# EAGLE design tiny2313_stepper_B (EAGLE 5.02)
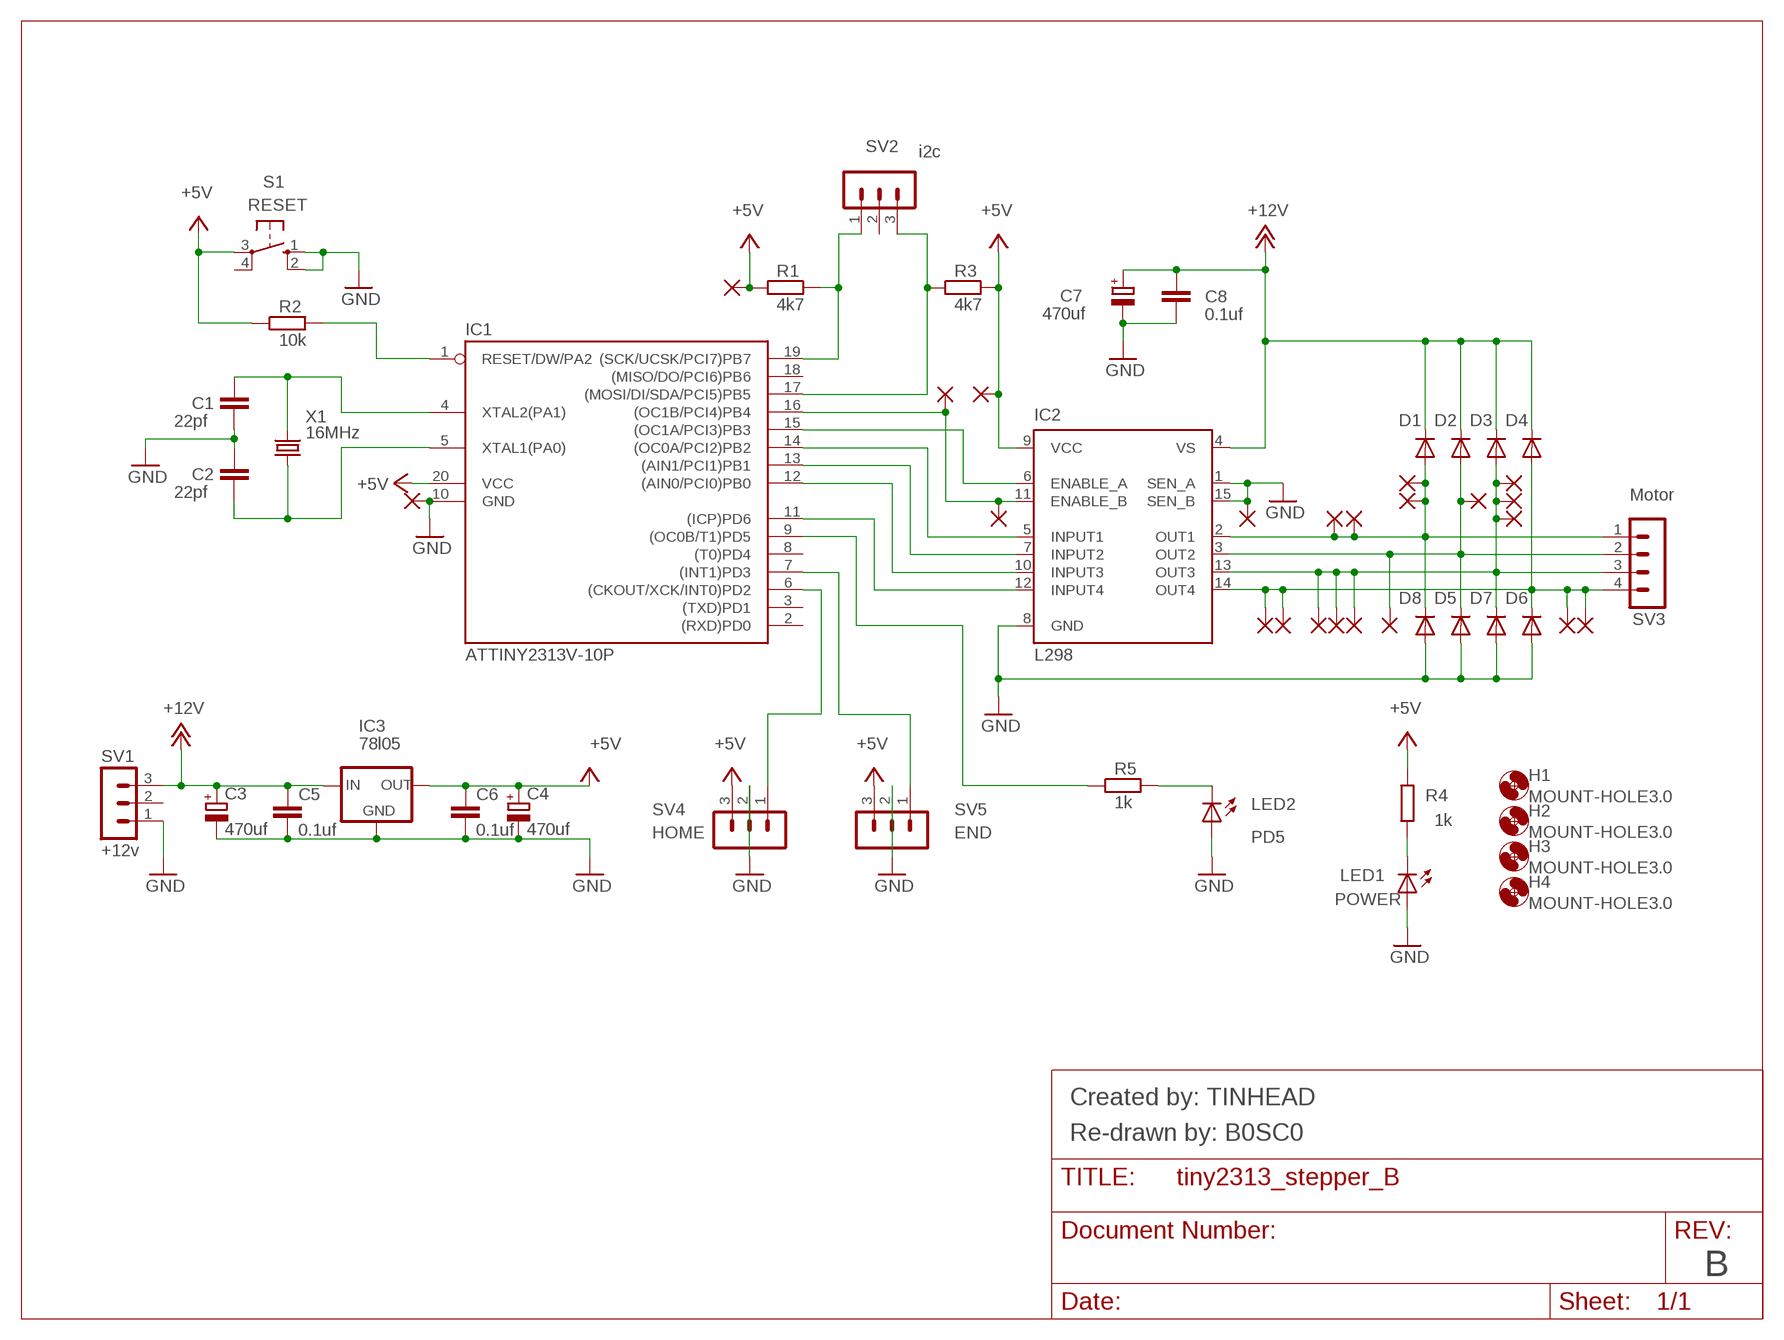
[diagram p0: schematic, sheet 1]

## Parts
C1  22pf  C-EU025-024X044  [C025-024X044]
C2  22pf  C-EU025-024X044  [C025-024X044]
C3  470uf  CPOL-EUE3.5-8  [E3,5-8]
C4  470uf  CPOL-EUE3.5-8  [E3,5-8]
C5  0.1uf  C-EU025-025X050  [C025-025X050]
C6  0.1uf  C-EU025-025X050  [C025-025X050]
C7  470uf  CPOL-EUE3.5-8  [E3,5-8]
C8  0.1uf  C-EU025-025X050  [C025-025X050]
D1  1N4004  [DO41-10]
D2  1N4004  [DO41-10]
D3  1N4004  [DO41-10]
D4  1N4004  [DO41-10]
D5  1N4004  [DO41-10]
D6  1N4004  [DO41-10]
D7  1N4004  [DO41-10]
D8  1N4004  [DO41-10]
H1  MOUNT-HOLE3.0  [3,0]
H2  MOUNT-HOLE3.0  [3,0]
H3  MOUNT-HOLE3.0  [3,0]
H4  MOUNT-HOLE3.0  [3,0]
IC1  ATTINY2313V-10P  [DIL20]
IC2  L298  [MULTIWATT-15]
IC3  78l05  78LXX  [78LXX]
LED1  POWER  LED5MM  [LED5MM]
LED2  PD5  LED5MM  [LED5MM]
PAD1  1,6/0,9  [1,6/0,9]
PAD2  1,6/0,9  [1,6/0,9]
PAD3  1,6/0,9  [1,6/0,9]
PAD4  1,6/0,9  [1,6/0,9]
PAD5  1,6/0,9  [1,6/0,9]
PAD6  1,6/0,9  [1,6/0,9]
PAD7  1,6/0,9  [1,6/0,9]
PAD8  1,6/0,9  [1,6/0,9]
PAD9  1,6/0,9  [1,6/0,9]
PAD10  1,6/0,9  [1,6/0,9]
PAD11  1,6/0,9  [1,6/0,9]
PAD12  1,6/0,9  [1,6/0,9]
PAD13  1,6/0,9  [1,6/0,9]
PAD14  1,6/0,9  [1,6/0,9]
PAD15  1,6/0,9  [1,6/0,9]
PAD16  1,6/0,9  [1,6/0,9]
PAD17  1,6/0,9  [1,6/0,9]
PAD18  1,6/0,9  [1,6/0,9]
PAD19  1,6/0,9  [1,6/0,9]
PAD20  1,6/0,9  [1,6/0,9]
PAD21  1,6/0,9  [1,6/0,9]
PAD22  1,6/0,9  [1,6/0,9]
R1  4k7  R-EU_0204/7  [0204/7]
R2  10k  R-EU_0204/7  [0204/7]
R3  4k7  R-EU_0204/7  [0204/7]
R4  1k  R-EU_0204/7  [0204/7]
R5  1k  R-EU_0204/7  [0204/7]
S1  RESET  10-XX  [B3F-10XX]
SV1  +12v  MA03-1  [MA03-1]
SV2  i2c  MA03-1  [MA03-1]
SV3  Motor  MA04-1  [MA04-1]
SV4  HOME  MA03-1  [MA03-1]
SV5  END  MA03-1  [MA03-1]
X1  16MHz  CRYSTALHC49S  [HC49/S]

## Nets
+5V: C4.+ C6.1 IC1.20(VCC) IC2.9(VCC) IC3.OUT PAD7.1(P) PAD8.1(P) R1.2 R2.1 R3.2 R4.2 S1.3(P) SV4.3 SV5.3
+12V: C3.+ C5.1 C7.+ C8.1 D1.C D2.C D3.C D4.C IC2.4(VS) IC3.IN SV1.3
GND: C1.1 C2.1 C3.- C4.- C5.2 C6.2 C7.- C8.2 D5.A D6.A D7.A D8.A IC1.10(GND) IC2.1(SEN_A) IC2.8(GND) IC2.15(SEN_B) IC3.GND LED1.A LED2.A PAD17.1(P) PAD18.1(P) S1.1(S) S1.2(S1) SV1.1 SV4.2 SV5.2
N$1: C2.2 IC1.5(XTAL1(PA0)) X1.1
N$3: IC1.1(RESET/DW/PA2) R2.2
N$4: C1.2 IC1.4(XTAL2(PA1)) X1.2
N$5: IC1.17((MOSI/DI/SDA/PCI5)PB5) R3.1 SV2.3
N$6: IC1.6((CKOUT/XCK/INT0)PD2) SV4.1
N$7: IC1.16((OC1B/PCI4)PB4) IC2.11(ENABLE_B) PAD11.1(P) PAD12.1(P)
N$8: IC1.15((OC1A/PCI3)PB3) IC2.6(ENABLE_A)
N$9: IC1.14((OC0A/PCI2)PB2) IC2.5(INPUT1)
N$10: IC1.13((AIN1/PCI1)PB1) IC2.7(INPUT2)
N$11: IC1.12((AIN0/PCI0)PB0) IC2.10(INPUT3)
N$12: IC1.11((ICP)PD6) IC2.12(INPUT4)
N$13: IC1.7((INT1)PD3) SV5.1
N$14: D1.A D8.C IC2.2(OUT1) PAD3.1(P) PAD4.1(P) PAD5.1(P) PAD6.1(P) SV3.1
N$15: D2.A D5.C IC2.3(OUT2) PAD9.1(P) PAD10.1(P) SV3.2
N$16: D3.A D7.C IC2.13(OUT3) PAD13.1(P) PAD14.1(P) PAD15.1(P) PAD16.1(P) PAD21.1(P) PAD22.1(P) SV3.3
N$18: D4.A D6.C IC2.14(OUT4) PAD1.1(P) PAD2.1(P) PAD19.1(P) PAD20.1(P) SV3.4
N$19: LED1.K(C) R4.1
N$20: LED2.K(C) R5.2
N$22: IC1.9((OC0B/T1)PD5) R5.1
N$23: IC1.19((SCK/UCSK/PCI7)PB7) R1.1 SV2.1
Unconnected: IC1.2((RXD)PD0) IC1.3((TXD)PD1) IC1.8((T0)PD4) IC1.18((MISO/DO/PCI6)PB6) S1.4(P1) SV1.2 SV2.2

## Notes on the sheet
- Created by: TINHEAD
- Re-drawn by: B0SC0
- B

## Library data of the parts
C1 C2 = resistor:C-EU: CAPACITOR, European symbol
C3 C4 C7 = rcl:CPOL-EU: POLARIZED CAPACITOR, European symbol
C5 C6 C8 = rcl:C-EU: CAPACITOR, European symbol
D1-D8 = diode:1N4004: DIODE general purpose rectifier, 1 A
H1-H4 = holes:MOUNT-HOLE: MOUNTING HOLE with drill center marker
IC1 = avr:ATTINY2313: MICROCONTROLLER 2 Kbytes FLASH 128 bytes SRAM 128 bytes EEPROM USART USI
IC2 = st-microelectronics:L298: DUAL FULL-BRIDGE DRIVER
IC3 = v-reg:78LXX: VOLTAGE REGULATOR
LED1 LED2 = led:LED: LED OSRAM: - CHIPLED LG R971, LG N971, LY N971, LG Q971, LY Q971, LO R971, LY R971 LH N974, LH R974 LS Q976, LO Q976, LY Q976 LO Q996 - Hyper CHIPLED LW Q18S LB Q993, LB Q99A, LB R99A - SideLED LS A670, LO A670, LY A670, LG A670, LP A670 LB A673, LV A673, LT A673, LW A673 LH A674 LY A675 LS A676, LA A676, LO A676, LY A676, LW A676 LS A679, LY A679, LG A679 - Hyper Micro SIDELED® LS Y876, LA Y876, LO Y876, LY Y876 LT Y87S - SmartLED LW L88C, LW L88S LB L89C, LB L89S, LG L890 LS L89K, LO L89K, LY L89K LS L896, LA L896, LO L896, LY L896 - TOPLED LS T670, LO T670, LY T670, LG T670, LP T670 LSG T670, LSP T670, LSY T670, LOP T670, LYG T670 LG T671, LOG T671, LSG T671 LB T673, LV T673, LT T673, LW T673 LH T674 LS T676, LA T676, LO T676, LY T676, LB T676, LH T676, LSB T676, LW T676 LB T67C, LV T67C, LT T67C, LS T67K, LO T67K, LY T67K, LW E67C LS E67B, LA E67B, LO E67B, LY E67B, LB E67C, LV E67C, LT E67C LW T67C LS T679, LY T679, LG T679 LS T770, LO T770, LY T770, LG T770, LP T770 LB T773, LV T773, LT T773, LW T773 LH T774 LS E675, LA E675, LY E675, LS T675 LS T776, LA T776, LO T776, LY T776, LB T776 LHGB T686 LT T68C, LB T68C - Hyper Mini TOPLED® LB M676 - Mini TOPLED Santana® LG M470 LS M47K, LO M47K, LY M47K Source: http://www.osram.convergy.de LUXEON: - LUMILED® LXK2-PW12-R00, LXK2-PW12-S00, LXK2-PW14-U00, LXK2-PW14-V00 LXK2-PM12-R00, LXK2-PM12-S00, LXK2-PM14-U00 LXK2-PE12-Q00, LXK2-PE12-R00, LXK2-PE12-S00, LXK2-PE14-T00, LXK2-PE14-U00 LXK2-PB12-K00, LXK2-PB12-L00, LXK2-PB12-M00, LXK2-PB14-N00, LXK2-PB14-P00, LXK2-PB14-Q00 LXK2-PR12-L00, LXK2-PR12-M00, LXK2-PR14-Q00, LXK2-PR14-R00 LXK2-PD12-Q00, LXK2-PD12-R00, LXK2-PD12-S00 LXK2-PH12-R00, LXK2-PH12-S00 LXK2-PL12-P00, LXK2-PL12-Q00, LXK2-PL12-R00 Source: www.luxeon.com KINGBRIGHT: KA-3528ASYC Source: www.kingbright.com
PAD1-PAD22 = wirepad:1,6/0,9: THROUGH-HOLE PAD
R1 R3 = resistor:R-EU_: RESISTOR, European symbol
R2 R4 R5 = rcl:R-EU_: RESISTOR, European symbol
S1 = switch-omron:10-XX: OMRON SWITCH
SV1 SV2 SV4 SV5 = con-lstb:MA03-1: PIN HEADER
SV3 = con-lstb:MA04-1: PIN HEADER
X1 = crystal:CRYSTAL: CRYSTAL

## Board
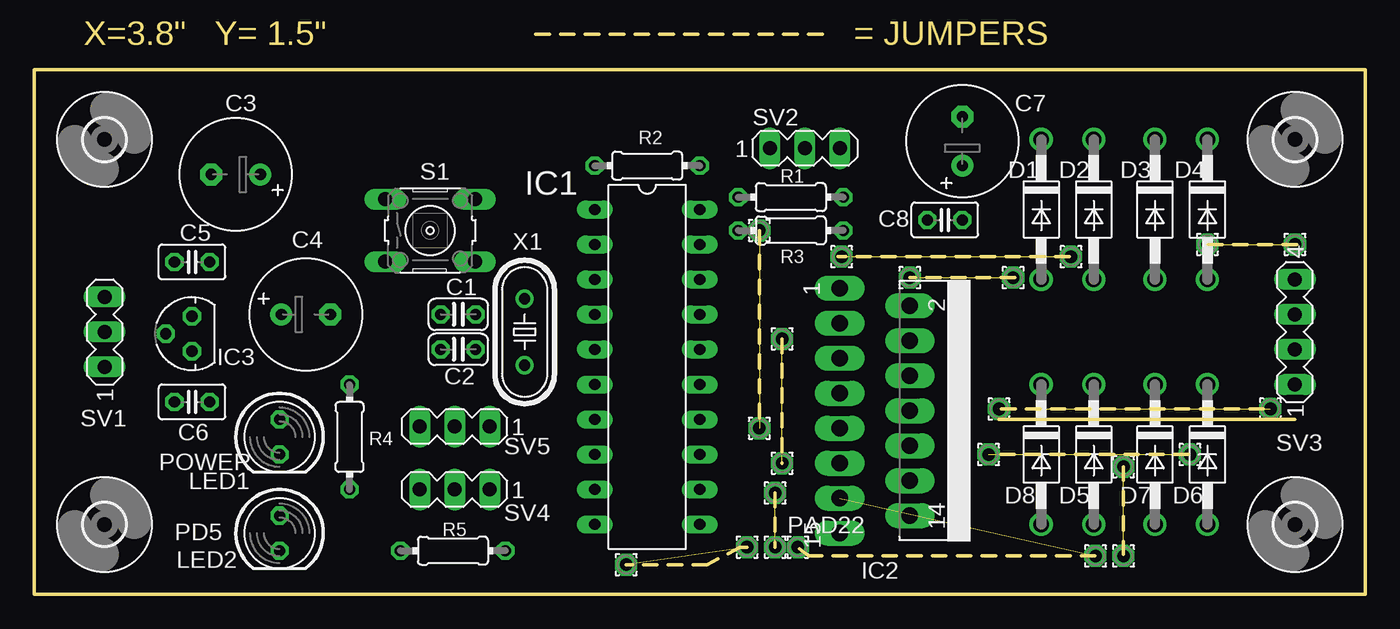
[diagram p1: board, top side]
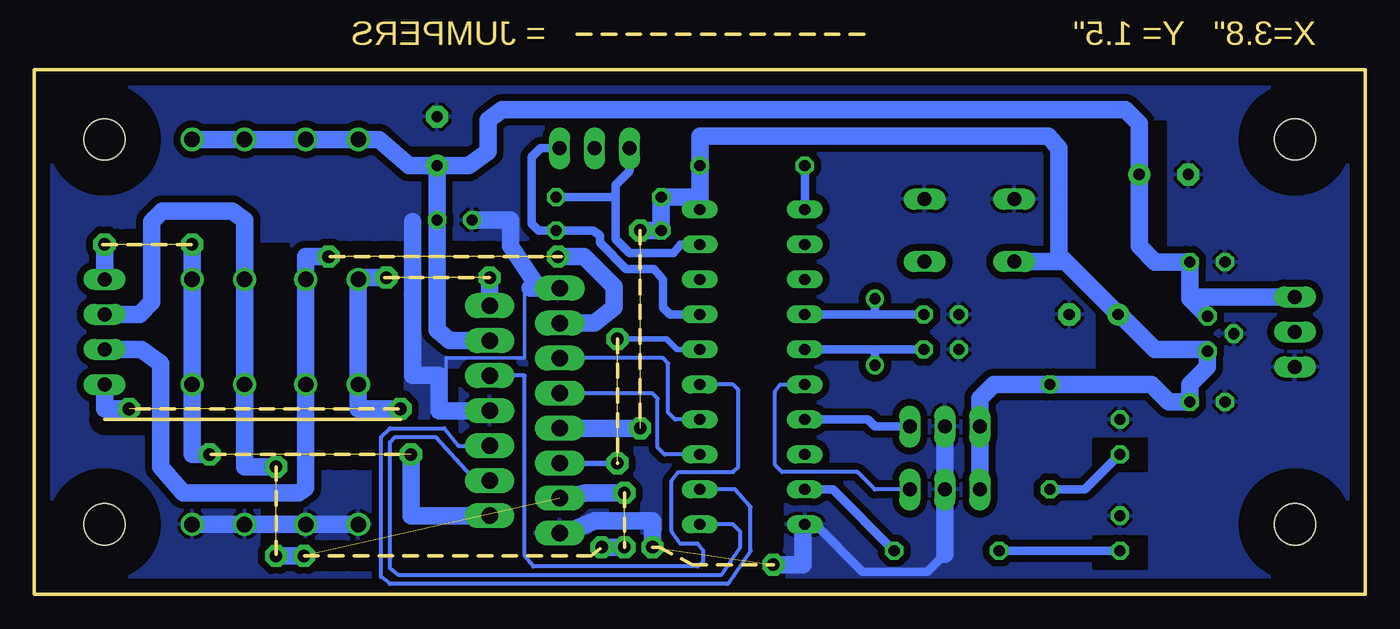
[diagram p2: board, bottom side, seen from below]

Size 96.52 x 40.64 mm. Coordinates in mm from the lower left corner, seen from the top.
Outline: 89.15,13.46 69.98,13.46
Outline: 91.57,25.4 85.09,25.4
Outline: 71.12,22.99 63.5,22.99
Outline: 52.58,26.42 52.58,12.06
Outline: 75.06,24.51 58.29,24.51
Outline: 54.23,18.54 54.23,9.53
Outline: 78.99,9.27 78.99,2.92
Outline: 55.5,3.3 56.13,2.79 76.96,2.79
Outline: 51.69,3.43 51.18,3.43 48.77,2.16 42.93,2.16
Outline: 57.15,40.64 35.69,40.64
Outline: 83.69,10.16 69.34,10.16
Outline: 53.72,7.37 53.72,3.43
Outline: 0,0 96.52,0 96.52,38.1 0,38.1 0,0
Copper layers (1+16): Top 0.035mm / dielectric 1.5mm / Bottom 0.035mm
Design rules "default *": minimum track width 10mil, minimum drill 24mil, track to track 20mil, track to pad 20mil, pad to pad 20mil, via to via 20mil, smd to smd 20mil, copper to edge 40mil, drill to drill 8mil, minimum pad ring 10mil, minimum via ring 8mil, stop-mask expansion 4mil, vias tented up to drill 0mil, thermal gap 10mil
bRestrict: area 78.1,14.5 to 79.9,25.4; area 70,14.6 to 71.8,21.6; area 69.8,14.9 to 71.6,21.6; area 70.1,14.7 to 71.9,21.7; area 14.5,25.5 to 19.7,34.3; area 15.5,16.4 to 19.4,22.4; area 15.9,9 to 19.7,11.3; area 15.9,1.9 to 19.7,4.2; area 64.9,30.1 to 69.5,32.4; area 42.3,3.4 to 46.4,31.8; area 60.1,17.1 to 61.8,23.9; area 65.9,10.2 to 67.7,16.3; 1 more areas

### Footprints (pad centres in the part's own frame; a part is rotated, then mirrored left to right if it is on the bottom)
C025-024X044 = drill 0.813 octagon: 1 -1.27,0; 2 1.27,0
E3,5-8 = drill 0.813 pad 1.6 round: + -1.778,0 | drill 0.813 pad 1.6 octagon: - 1.778,0
C025-025X050 = drill 0.813 octagon: 1 -1.27,0; 2 1.27,0
DO41-10 = drill 1.118 round: A 5.08,0; C -5.08,0
3,0 = hole 3: 0,0
DIL20 = drill 0.813 long: 1 -11.43,-3.81; 2 -8.89,-3.81; 3 -6.35,-3.81; 4 -3.81,-3.81; 5 -1.27,-3.81; 6 1.27,-3.81; 7 3.81,-3.81; 8 6.35,-3.81; 9 8.89,-3.81; 10 11.43,-3.81; 11 11.43,3.81; 12 8.89,3.81; 13 6.35,3.81; 14 3.81,3.81; 15 1.27,3.81; 16 -1.27,3.81; 17 -3.81,3.81; 18 -6.35,3.81; 19 -8.89,3.81; 20 -11.43,3.81
MULTIWATT-15 = drill 1.2 long: 1 -8.89,-7.62; 2 -7.62,-2.54; 3 -6.35,-7.62; 4 -5.08,-2.54; 5 -3.81,-7.62; 6 -2.54,-2.54; 7 -1.27,-7.62; 8 0,-2.54; 9 1.27,-7.62; 10 2.54,-2.54; 11 3.81,-7.62; 12 5.08,-2.54; 13 6.35,-7.62; 14 7.62,-2.54; 15 8.89,-7.62
78LXX = drill 0.813 octagon: GND 0,1.905; IN 1.27,0; OUT -1.27,0
LED5MM = drill 0.813 octagon: A -1.27,0; K 1.27,0
1,6/0,9 = drill 0.914 pad 1.6 octagon: 1 0,0
0204/7 = drill 0.813 octagon: 1 -3.81,0; 2 3.81,0
B3F-10XX = drill 1.016 long: 1 -3.251,2.261; 2 3.251,2.261; 3 -3.251,-2.261; 4 3.251,-2.261
MA03-1 = drill 1.016 long: 1 -2.54,0; 2 0,0; 3 2.54,0
MA04-1 = drill 1.016 long: 1 -3.81,0; 2 -1.27,0; 3 1.27,0; 4 3.81,0
HC49/S = drill 0.813 round: 1 -2.413,0; 2 2.413,0

### Placement (x,y rotation side)
C1  30.73,20.32 0 top
C2  30.73,17.78 0 top
C3  14.61,30.48 180 top
C4  19.68,20.32 0 top
C5  11.43,24.13 180 top
C6  11.43,13.97 180 top
C7  67.31,32.89 90 top
C8  66.04,27.18 180 top
D1  73.03,27.94 270 top
D2  76.83,27.94 270 top
D3  81.28,27.94 270 top
D4  85.09,27.94 270 top
D5  76.83,10.16 270 top
D6  85.09,10.16 270 top
D7  81.28,10.16 270 top
D8  73.03,10.16 270 top
H1  5.08,33.02 0 top
H2  5.08,5.08 0 top
H3  91.44,5.08 0 top
H4  91.44,33.02 0 top
IC1  44.45,16.51 270 top
IC2  66.04,13.34 270 top
IC3  11.43,18.92 90 top
LED1  17.78,11.43 270 top
LED2  17.78,4.45 270 top
PAD1  91.44,25.4 0 top
PAD2  85.09,25.4 0 top
PAD3  89.66,13.46 0 top
PAD4  69.98,13.46 0 top
PAD5  70.99,22.99 0 top
PAD6  63.5,22.99 0 top
PAD7  52.58,12.06 0 top
PAD8  52.58,26.42 0 top
PAD9  58.55,24.51 0 top
PAD10  75.18,24.51 0 top
PAD11  54.23,18.54 0 top
PAD12  54.23,9.53 0 top
PAD13  53.72,7.37 0 top
PAD14  78.99,9.27 0 top
PAD15  76.96,2.79 0 top
PAD16  78.99,2.79 0 top
PAD17  51.69,3.43 0 top
PAD18  42.93,2.16 0 top
PAD19  69.22,10.16 0 top
PAD20  83.82,10.16 0 top
PAD21  53.72,3.43 0 top
PAD22  55.37,3.43 0 top
R1  54.86,28.83 180 top
R2  44.45,31.11 180 top
R3  54.86,26.42 180 top
R4  22.86,11.43 90 top
R5  30.35,3.17 180 top
S1  28.7,26.42 0 top
SV1  5.08,19.05 90 top
SV2  55.88,32.38 0 top
SV3  91.44,19.05 90 top
SV4  30.48,7.62 180 top
SV5  30.48,12.19 180 top
X1  35.56,19.05 90 top

### Tracks (layer width: path | path; a pad name or v marks a point on that pad's centre or on a via)
+5V  (1 unrouted)
  Bottom 0.305: 17.78,20.32 C4.+ | 11.43,17.78 IC3.OUT | SV4.3 SV5.3
  Bottom 1.27: 17.78,20.32 15.24,17.78 11.43,17.78 11.43,16.51 12.7,15.24 C6.1 14.22,13.97 15.49,15.24 R4.2 26.92,15.24 27.94,14.22 SV4.3 | 48.26,28.83 R2.1 48.26,33.27 22.99,33.27 22.23,32.38 22.23,24.64 21.84,24.26 | C4.+ 17.91,20.45 18.03,20.45 21.84,24.26 | S1.3 21.95,24.16 21.84,24.26 | 48.26,28.83 R1.2 R3.2 PAD8.1 | 48.26,28.83 IC1.20 | PAD7.1 IC2.9
+12V
  Bottom 0.305: 12.7,21.59 IC3.IN
  Bottom 1.27: IC3.IN 12.7,21.46 12.7,21.59 | 12.7,21.59 C5.1 15.24,24.13 16.38,25.27 C3.+ 16.38,34.16 17.4,35.18 62.61,35.18 63.63,34.42 63.63,32.13 65.02,31.11 C7.+ | SV1.3 12.7,21.59 | D4.C D3.C D2.C D1.C 71.5,33.02 69.34,31.11 C7.+ | C7.+ C8.1 67.31,19.18 66.42,18.41 IC2.4
GND  (1 unrouted)
  Bottom 0.254: 60.58,22.23 60.96,22.23 60.96,17.14 66.67,17.14 66.67,13.34 65.91,13.34
  Bottom 0.61: 30.48,2.92 31.75,1.65 36.45,1.65 39.88,5.08 IC1.10 40.77,5.08
  Bottom 1.27: 30.48,2.92 SV5.2 | D6.A D7.A D5.A D8.A | 40.77,5.08 40.77,2.16 PAD18.1 | 59.94,22.23 61.98,25.27 61.98,27.18 C8.2 | 60.58,22.23 59.94,22.23 | 59.94,22.23 IC2.1 | 65.91,13.34 IC2.8 67.18,13.34 67.18,15.88 69.09,15.88 69.09,27.05 | IC2.15 58.04,4.45 55.88,5.33 51.69,5.33 PAD17.1
  pour Bottom: 0,38.1 0,0 96.52,0 96.52,38.1
N$1
  Bottom 0.61: C2.2 35.56,17.78 | 35.56,17.78 IC1.5 | 35.56,17.78 X1.1
N$3
  Bottom 0.61: IC1.1 R2.2
N$4
  Bottom 0.61: C1.2 35.56,20.32 | 35.56,20.32 IC1.4 | 35.56,20.32 X1.2
N$5
  Bottom 0.61: SV2.3 59.82,32.38 60.45,31.75 60.45,26.92 59.94,26.42 R3.1 56.01,26.42 55.5,26.04 55.5,25.53 53.59,23.62 51.56,23.62 50.93,22.86 50.93,20.83 50.42,20.32 IC1.17
N$6
  Bottom 0.305: IC1.6 42.42,15.24 42.8,14.73 42.8,9.4 42.29,8.89 36.83,8.89 35.56,7.62 SV4.1
N$7  (1 unrouted)
  Bottom 0.406: PAD11.1 50.67,18.54 49.91,17.78 IC1.16 | PAD12.1 IC2.11
N$8
  Bottom 0.305: IC2.6 60.96,15.88 60.96,2.79 60.33,2.03 48.39,2.03 48.01,2.41 48.01,3.17 48.39,3.68 49.66,3.68 50.29,4.57 50.29,8.26 49.78,8.89 45.85,8.89 45.47,9.27 45.47,14.86 45.85,15.24 IC1.15
N$9
  Bottom 0.305: IC2.5 50.93,17.14 50.55,16.76 50.55,13.21 50.04,12.7 IC1.14
N$10
  Bottom 0.305: IC2.7 51.69,14.61 51.31,14.22 51.31,10.67 50.8,10.16 IC1.13
N$11
  Bottom 0.305: IC1.12 45.72,7.62 44.58,6.35 44.58,3.17 46.23,0.76 70.74,0.76 71.37,1.27 71.37,11.43 70.74,12.06 66.8,12.06 65.79,10.79 IC2.10
N$12
  Bottom 0.305: IC1.11 45.85,5.08 45.34,4.57 45.34,3.43 46.74,1.4 70.1,1.4 70.74,1.91 70.74,11.05 70.36,11.43 67.44,11.43 64.52,8.26 IC2.12
N$13
  Bottom 0.61: IC1.7 36.07,12.7 35.56,12.19 SV5.1
N$14  (2 unrouted)
  Bottom 1.27: PAD4.1 73.03,13.46 D8.C D1.A 73.03,22.99 PAD5.1 | IC2.2 PAD6.1 | SV3.1 91.44,13.46 PAD3.1
N$15  (1 unrouted)
  Bottom 1.27: SV3.2 88.77,17.78 87.38,16.76 87.38,9.27 85.72,7.37 77.34,7.37 76.83,7.75 D5.C D2.A 76.83,24.51 PAD10.1 | PAD9.1 56.64,24.51 54.48,22.35 54.48,20.83 55.88,19.68 IC2.3
N$16  (3 unrouted)
  Bottom 1.27: SV3.3 88.9,20.32 88.01,21.21 88.01,27.05 87.25,27.81 82.17,27.81 81.28,27.18 D3.A D7.C 81.28,9.27 PAD14.1 | PAD15.1 PAD16.1 78.99,2.92 79.12,2.92 | IC2.13 58.29,6.99 56.52,7.37 PAD13.1 | PAD22.1 PAD21.1
N$18  (2 unrouted)
  Bottom 1.27: 85.22,25.4 PAD2.1 D4.A 85.09,15.49 85.22,15.37 D6.C 85.09,10.16 PAD20.1 | PAD19.1 69.22,5.71 IC2.14 | SV3.4 PAD1.1
N$19
  Bottom 0.61: LED1.K 20.32,7.62 R4.1
N$20
  Bottom 0.61: LED2.K R5.2
N$22
  Bottom 0.61: IC1.9 38.61,7.62 R5.1
N$23
  Bottom 0.61: 54.36,28.83 R1.1 | IC1.19 49.66,25.4 50.16,24.77 53.34,24.77 54.36,25.78 54.36,28.83 | SV2.1 53.34,30.73 54.36,29.72 54.36,28.83

### Text on the board
Dimension: X=3.8" Y= 1.5" | = JUMPERS
tNames: POWER | PD5